# EasyEDA Pro project Chassis.epro

# Schematic Schematic1
Create Date: 2024-09-16; Page Name: P1; Project Name: 底盘控制模块916; Schematic Name: Schematic1; Update Date: 2024-09-16; Company: 嘉立创EDA; Page Size: A4; Version: V1.0
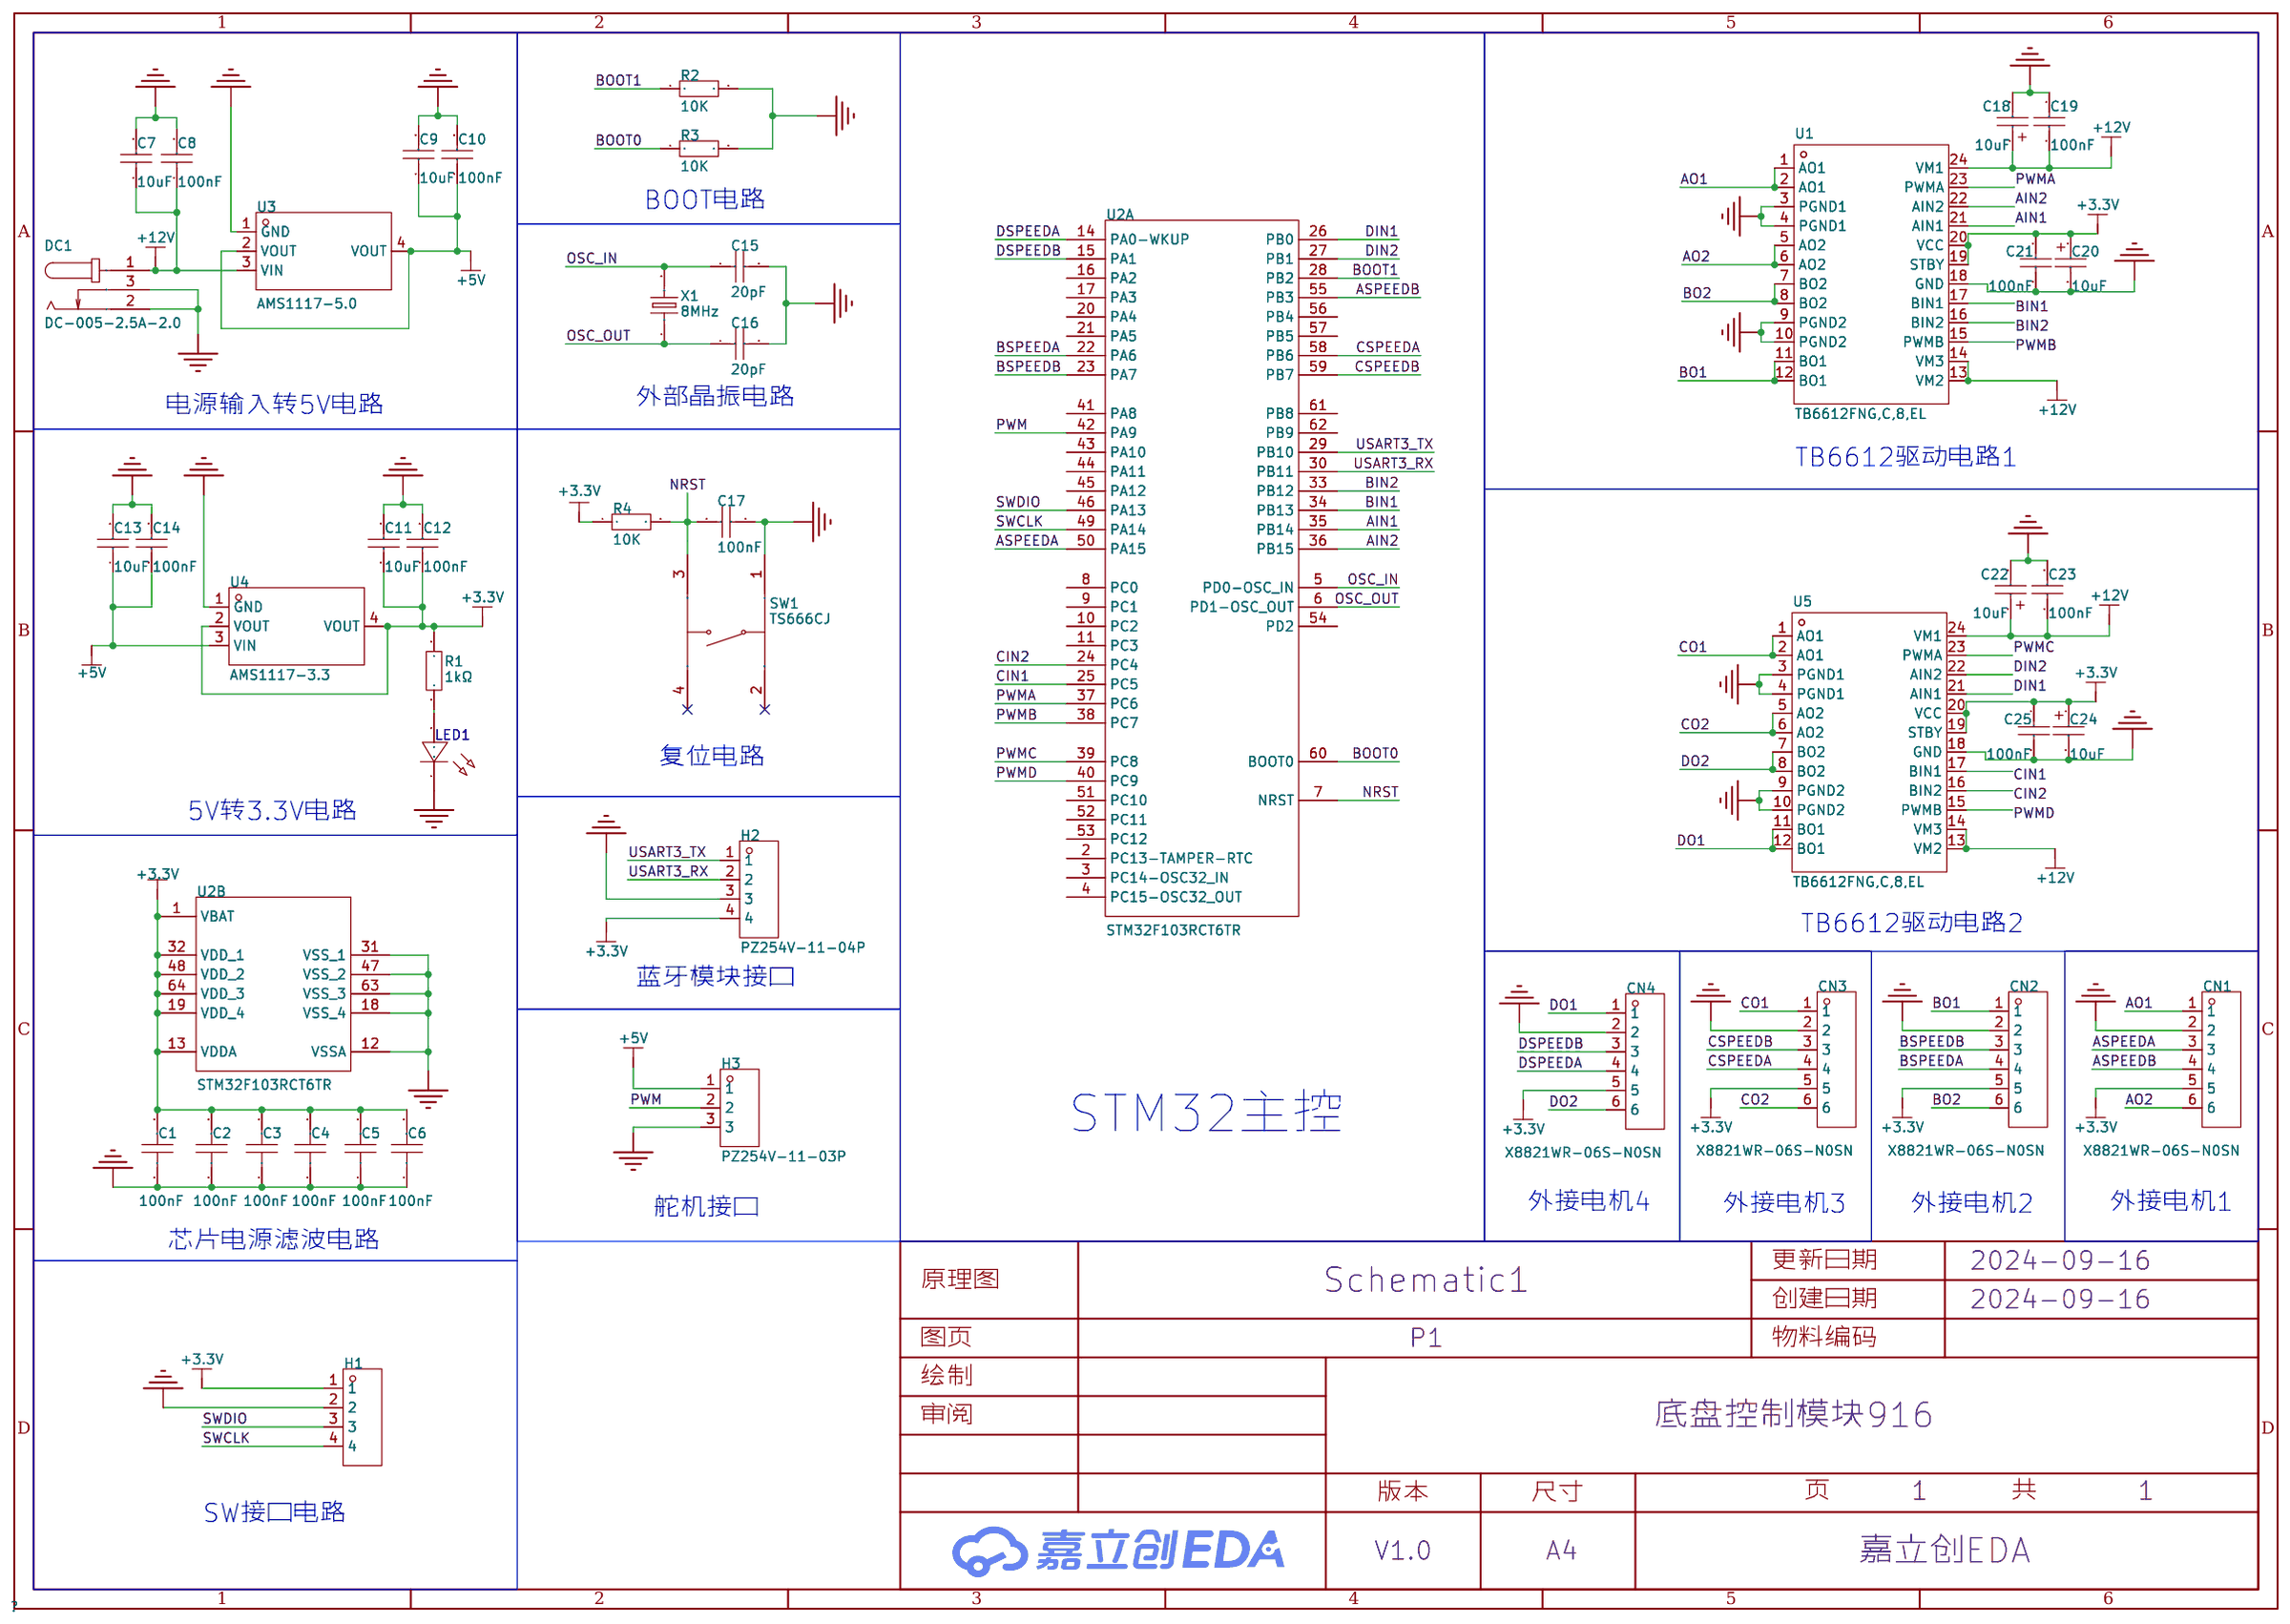
[diagram p0: schematic sheet]

## Parts
C1  100nF  [C0603]
C2  100nF  [C0603]
C3  100nF  [C0603]
C4  100nF  [C0603]
C5  100nF  [C0603]
C6  100nF  [C0603]
C7  10uF  [C0402]
C8  100nF  [C0402]
C9  10uF  [C0402]
C10  100nF  [C0402]
C11  10uF  [C0402]
C12  100nF  [C0402]
C13  10uF  [C0402]
C14  100nF  [C0402]
C15  20pF  [C0402]
C16  20pF  [C0402]
C17  100nF  [C0402]
C18  10uF  [CAP-SMD_L3.2-W1.6-RD-C7171]
C19  100nF  [C0402]
C20  10uF  [CAP-SMD_L3.2-W1.6-RD-C7171]
C21  100nF  [C0402]
C22  10uF  [CAP-SMD_L3.2-W1.6-RD-C7171]
C23  100nF  [C0402]
C24  10uF  [CAP-SMD_L3.2-W1.6-RD-C7171]
C25  100nF  [C0402]
CN1  X8821WR-06S-N0SN  [CONN-TH_6P-P2.50_X8821WR-06S-N2SN]
CN2  X8821WR-06S-N0SN  [CONN-TH_6P-P2.50_X8821WR-06S-N2SN]
CN3  X8821WR-06S-N0SN  [CONN-TH_6P-P2.50_X8821WR-06S-N2SN]
CN4  X8821WR-06S-N0SN  [CONN-TH_6P-P2.50_X8821WR-06S-N2SN]
DC1  DC-005-2.5A-2.0  [CONN-TH_DC-005-2.5A-2.0]
H1  -  [HDR-TH_4P-P2.54-V-M]
H2  PZ254V-11-04P  [HDR-TH_4P-P2.54-V-M]
H3  PZ254V-11-03P  [HDR-TH_3P-P2.54-V-M]
LED1  -  [LED_0805]
R1  1kΩ  [R0603]
R2  10K  [R0603]
R3  10K  [R0603]
R4  10K  [R0603]
SW1  TS666CJ  [SW-TH_4P-L6.0-W6.0-P4.50-LS6.5]
U1  TB6612FNG,C,8,EL  [SSOP-24_L8.3-W5.6-P0.65-LS7.6-BL]
U2  STM32F103RCT6TR  [LQFP-64_L10.0-W10.0-P0.50-LS12.0-BL]  (sections 1,2)
U3  AMS1117-5.0  [SOT-223_L6.5-W3.5-P2.30-LS7.0-BR]
U4  AMS1117-3.3  [SOT-223-3_L6.5-W3.4-P2.30-LS7.0-BR]
U5  TB6612FNG,C,8,EL  [SSOP-24_L8.3-W5.6-P0.65-LS7.6-BL]
X1  8MHz  [HC-49US_L11.5-W4.5-P4.88]

## Library data of the parts
C1-C6 = CAP_0603: Supplier Footprint: 0603
C7 C9 C11 C13 = CL05A106MQ5NUNC: 容值:10uF;精度:±20%;额定电压:6.3V;材质(温度系数):X5R;; LCSC Part Name: 10uF ±20% 6.3V; Supplier Part: C15525; Manufacturer: SAMSUNG(三星); Supplier Footprint: 0402; JLCPCB Part Class: 基础库; Datasheet: https://atta.szlcsc.com/upload/public/pdf/source/20220823/2B02EE04F8F211D38A52DCB16EB6BEBA.pdf; Supplier: LCSC; Tolerance: ±20%; Voltage Rated: 6.3V; Temperature Coefficient: X5R
C8 C10 C12 C14 C17 C19 C21 C23 C25 = CL05B104KO5NNNC: 容值:100nF;精度:±10%;额定电压:16V;材质(温度系数):X7R;; LCSC Part Name: 100nF ±10% 16V; Supplier Part: C1525; Manufacturer: SAMSUNG(三星); Supplier Footprint: 0402; JLCPCB Part Class: 基础库; Datasheet: https://atta.szlcsc.com/upload/public/pdf/source/20160218/1457707763339.pdf; Supplier: LCSC; Tolerance: ±10%; Voltage Rated: 16V; Temperature Coefficient: X7R
C15 C16 = 0402CG200J500NT: 容值:20pF;精度:±5%;额定电压:50V;材质(温度系数):C0G;; LCSC Part Name: 20pF ±5% 50V; Supplier Part: C1554; Manufacturer: FH(风华); Supplier Footprint: 0402; JLCPCB Part Class: 基础库; Datasheet: https://atta.szlcsc.com/upload/public/pdf/source/20200305/C486355_26A10D38EF8C2A5C37091D0039909270.pdf; Supplier: LCSC; Tolerance: ±5%; Voltage Rated: 50V; Temperature Coefficient: C0G
C18 C20 C22 C24 = TAJA106K016RNJ: 容值:10uF;精度:±10%;额定电压:16V;等效串联电阻:3Ω@100kHz;; LCSC Part Name: 10uF ±10% 16V; Supplier Part: C7171; Manufacturer: Kyocera AVX; Supplier Footprint: CASE-A-3216; JLCPCB Part Class: 基础库; Datasheet: https://atta.szlcsc.com/upload/public/pdf/source/20160107/1457707750344.pdf; Supplier: LCSC; Tolerance: ±10%; Rated Voltage: 16V; Equivalent Series Resistance(ESR): 3Ω@100kHz; Operating Temperature: -55℃~+125℃
CN1-CN4 = X8821WR-06S-N0SN: 插针结构:1x6P;间距:2.5mm;安装方式:弯插;参考系列:XH;总PIN数:6P;排数:1;每排PIN数:6;行距:-;额定电流:3A;触头材质:黄铜;触头镀层:锡;工作温度范围:-;; LCSC Part Name: 1x6P 间距:2.5mm 弯插 系列:XH; Supplier Part: C388743; Manufacturer: XKB Connection(中国星坤); Supplier Footprint: 弯插,P=2.54mm; JLCPCB Part Class: 扩展库; Datasheet: https://atta.szlcsc.com/upload/public/pdf/source/20211009/984C14C41D2B1156BCF8EEF5D296E395.pdf; Supplier: LCSC; Pins Structure: 1x6P; Pitch: 2.5mm; Mounting Style: 弯插; Reference Series: XH; Number of Pins: 6P; Number of Rows: 1; Number of PINs Per Row: 6; Current Rating (Max): 3A; Contact Material: 黄铜; Contact Plating: 锡
DC1 = DC-005-2.5A-2.0: 连接器类型:DC电源插座;安装方式:面板安装;触点内径:2mm;触点外径:6.2mm;额定电流:-;额定电压:-;触头材质:黄铜;触头镀层:-;工作温度范围:-20℃~+70℃;焊接温度(最大值):260℃;; LCSC Part Name: DC电源插座 内径:2mm 外径:6.2mm; Supplier Part: C319099; Manufacturer: XKB Connection(中国星坤); Supplier Footprint: 插件; JLCPCB Part Class: 扩展库; Datasheet: https://atta.szlcsc.com/upload/public/pdf/source/20230410/3C172F25A51FCA230ABE6D36425CBB3B.pdf; Supplier: LCSC; Connector Type: DC电源插座; Mounting Style: 面板安装; Inside Contact Diameter: 2mm; Outside Contact Diameter: 6.2mm; Contact Material: 黄铜; Operating Temperature Range: -20℃~+70℃; Soldering Temperature(Max): 260℃
H1 = HDR-M_2.54_1x4P: Supplier Part: C492403; Supplier Footprint: 插件
H2 = PZ254V-11-04P: 插针结构:1x4P;间距:2.54mm;行距:-;圆针/方针:方针;安装类型:直插;排数:单排;总PIN位数:4P;额定电流:3A;额定电压:250V;配合针长度:6mm;塑高:2.5mm;端接针长度:3mm;触头材质:-;工作温度范围:-40℃~+105℃;颜色:黑色;; LCSC Part Name: 间距:2.54mm 1x4P 直插 方针; Supplier Part: C2691448; Manufacturer: XFCN(兴飞); Supplier Footprint: 插件,P=2.54mm; JLCPCB Part Class: 扩展库; Datasheet: https://atta.szlcsc.com/upload/public/pdf/source/20200309/C492403_F9F19131791D08044AD4F84F8E751A34.pdf; Supplier: LCSC; Pin Structure: 1x4P; Pitch: 2.54mm; Circluar Pins/Square Pins: 方针; Mounting Type: 直插; Number of Rows: 单排; Number of Pins: 4P; Current Rating (Max): 3A; Voltage Rating (Max): 250V; Length of Mating Pin: 6mm; Insulation Height: 2.5mm; Length of End Connection Pin: 3mm; Operating Temperature Range: -40℃~+105℃; Color: 黑色
H3 = PZ254V-11-03P: 插针结构:1x3P;间距:2.54mm;行距:-;圆针/方针:方针;安装类型:直插;排数:单排;总PIN位数:3P;额定电流:3A;额定电压:250V;配合针长度:6mm;塑高:2.5mm;端接针长度:3mm;工作温度范围:-40℃~+105℃;颜色:黑色;; LCSC Part Name: 间距:2.54mm 1x3P 直插 方针; Supplier Part: C2937625; Manufacturer: XFCN(兴飞); Supplier Footprint: 插件,P=2.54mm; JLCPCB Part Class: 扩展库; Datasheet: https://atta.szlcsc.com/upload/public/pdf/source/20200309/C492402_8335C3D49C4E4C618838D59BB1D024C1.pdf; Supplier: LCSC; Pin Structure: 1x3P; Pitch: 2.54mm; Circluar Pins/Square Pins: 方针; Mounting Type: 直插; Number of Rows: 单排; Number of Pins: 3P; Current Rating (Max): 3A; Voltage Rating (Max): 250V; Length of Mating Pin: 6mm; Insulation Height: 2.5mm; Length of End Connection Pin: 3mm; Operating Temperature Range: -40℃~+105℃; Color: 黑色
LED1 = LED_0805-B: Supplier Footprint: 0805
R1 = 0603WAF1001T5E: 电阻类型:厚膜电阻;阻值:1kΩ;精度:±1%;功率:100mW;最大工作电压:75V;温度系数:±100ppm/℃;; LCSC Part Name: 1kΩ ±1% 100mW 厚膜电阻; Supplier Part: C21190; Manufacturer: UNI-ROYAL(厚声); Supplier Footprint: 0603; JLCPCB Part Class: 基础库; Datasheet: https://atta.szlcsc.com/upload/public/pdf/source/20200306/C422600_1E6D84923E4A46A82E41ADD87F860B5C.pdf; Supplier: LCSC; Type: 厚膜电阻; Tolerance: ±1%; Power(Watts): 100mW; Overload Voltage (Max): 75V; Temperature Coefficient: ±100ppm/℃; Operating Temperature Range: -55℃~+155℃
R2-R4 = Res_0603: Supplier Footprint: 0603
SW1 = TS666CJ: 电路结构:单刀单掷;按钮形状:圆形按钮;作用力:250gf;安装方式:直插;开关长度:6mm;开关宽度:6mm;开关高度:6mm;带支架:不带;触点电流:50mA;额定电压(DC):12V;绝缘电阻:100MΩ;机械寿命:5万次;; LCSC Part Name: 6*6*6mm 直插 轻触开关; Supplier Part: C557621; Manufacturer: SHOU HAN(首韩); Supplier Footprint: 插件; JLCPCB Part Class: 扩展库; Datasheet: https://atta.szlcsc.com/upload/public/pdf/source/20200519/C557621_524FC94A9E7193E97F84899CC7F1F8B2.pdf; Supplier: LCSC; Circuit: 单刀单掷; Actuator Style: 圆形按钮; Operating Force: 250gf; Mounting Style: 直插; Switch Length: 6mm; Switch Width: 6mm; Switch Height: 6mm; Strike Gundam: 不带; Contact Current: 50mA; Voltage Rating (DC): 12V; Insulation Resistance: 100MΩ; Actuator/Cap Color: 黑色; Pin Style: PC引脚; Mechanical Life: 5万次; Operating Temperature: -20℃~+85℃
U1 U5 = TB6612FNG,C,8,EL: LCSC Part Name: 1A 有刷直流电机驱动芯片 5.5V; Supplier Part: C141517; Manufacturer: TOSHIBA(东芝); Supplier Footprint: SSOP-24; JLCPCB Part Class: 扩展库; Datasheet: https://atta.szlcsc.com/upload/public/pdf/source/20171128/C141517_15118625624231147036.pdf; Supplier: LCSC
U2 = STM32F103RCT6TR: CPU内核:ARM-M3;程序存储容量:256KB;RAM总容量:48KB;GPIO端口数量:51;工作电压范围:2V~3.6V;CPU最大主频:72MHz;程序存储器类型:FLASH;; LCSC Part Name: 主流增强型ARM Cortex-M3 MCU，具有256 KB Flash、72 MHz CPU、电机控制、USB和CAN; Supplier Part: C39704; Manufacturer: ST(意法半导体); Supplier Footprint: LQFP-64(10x10); JLCPCB Part Class: 扩展库; Datasheet: https://atta.szlcsc.com/upload/public/pdf/source/20151012/1457707442737.pdf; Supplier: LCSC; CPU Core: ARM-M3; Program Storage Size: 256KB; RAM Size: 48KB; GPIO Ports Number: 51; Operating Voltage Range: 2V~3.6V; CPU Maximum Speed: 72MHz; Program Memory Type: FLASH; Operating Temperature Range: -40℃~+85℃; ADC (Bit): 12bit; DAC (Bit): 12bit; Universal Serial Bus: 有; Peripheral/Function: 看门狗；DMA；看门狗；温度传感器; Watchdog: 有; Infrared Data Association: 有; Low-Voltage Detect: 有; Direct Memory Access: 有; Internal Oscillator: 有
U3 = AMS1117-5.0_C6187: 输出类型:固定;最大输入电压:12V;输出电压:5V;最大输出电流:1A;电源纹波抑制比(PSRR):68dB@(120Hz);输出极性:正极;; LCSC Part Name: 输入12V 输出5V 1A; Supplier Part: C6187; Manufacturer: AMS; Supplier Footprint: SOT-223; JLCPCB Part Class: 基础库; Datasheet: https://atta.szlcsc.com/upload/public/pdf/source/20230918/E4B716057EE82179D88E8A0894830D59.pdf; Supplier: LCSC; Output Type: 固定; Maximum Input Voltage: 12V; Output Voltage: 5V; MAX Output Current: 1A; Power Supply Rejection Ratio (PSRR): 68dB@(120Hz); Dropout Voltage: 1.3V@(1A); Output Polarity: 正极; Number of Outputs: 1
U4 = AMS1117-3.3_C6186: 输出类型:固定;最大输入电压:-;输出电压:3.3V;最大输出电流:1A;电源纹波抑制比(PSRR):72dB@(120Hz);输出极性:正极;; LCSC Part Name: 输出3.3V 1A; Supplier Part: C6186; Manufacturer: AMS; Supplier Footprint: SOT-223; JLCPCB Part Class: 基础库; Datasheet: https://atta.szlcsc.com/upload/public/pdf/source/20180727/C6186_7A095716F0823C02F1997A905E26C086.pdf; Supplier: LCSC; Output Type: 固定; Output Voltage: 3.3V; MAX Output Current: 1A; Power Supply Rejection Ratio (PSRR): 72dB@(120Hz); Dropout Voltage: 1.3V@(800mA); Output Polarity: 正极; Number of Outputs: 1
X1 = 49S-8.000-20-20-20/A: 晶振类型:直插晶振;频率:8MHz;常温频差:±20ppm;外接负载电容:20pF;频率稳定度(全温):±20ppm;; LCSC Part Name: 8MHz ±20ppm 20pF; Supplier Part: C240916; Manufacturer: LIMING(利明); Supplier Footprint: HC-49S; JLCPCB Part Class: 扩展库; Datasheet: https://atta.szlcsc.com/upload/public/pdf/source/20180930/C240954_D21D826943E58A9880472B1227802F84.pdf; Supplier: LCSC; Crystal Type: 直插晶振; Normal temperature Frequency Tolerance: ±20ppm; External load capacitor: 20pF; Frequency Stability(Full temperature range): ±20ppm; Operating Temperature: -20℃~+70℃

## Nets
+3.3V: C1.2 C2.2 C3.2 C4.2 C5.2 C6.2 C11.1 C12.1 C20.1 C21.1 C24.1 C25.1 CN1.5 CN2.5 CN3.5 CN4.5 H1.1 H2.4 R1.1 R4.1 U1.19(STBY) U1.20(VCC) U2.1(VBAT) U2.13(VDDA) U2.19(VDD_4) U2.32(VDD_1) U2.48(VDD_2) U2.64(VDD_3) U4.2(VOUT) U4.4(VOUT) U5.19(STBY) U5.20(VCC)
+5V: C9.1 C10.1 C13.1 C14.1 H3.1 U3.2(VOUT) U3.4(VOUT) U4.3(VIN)
+12V: C7.1 C8.1 C18.1 C19.1 C22.1 C23.1 DC1.1 U1.13(VM2) U1.14(VM3) U1.24(VM1) U3.3(VIN) U5.13(VM2) U5.14(VM3) U5.24(VM1)
GND: C1.1 C2.1 C3.1 C4.1 C5.1 C6.1 C7.2 C8.2 C9.2 C10.2 C11.2 C12.2 C13.2 C14.2 C15.2 C16.2 C17.1 C18.2 C19.2 C20.2 C21.2 C22.2 C23.2 C24.2 C25.2 CN1.2 CN2.2 CN3.2 CN4.2 DC1.2 DC1.3 H1.2 H2.3 H3.3 LED1.1(C) R2.2 R3.2 SW1.1(A) U1.3(PGND1) U1.4(PGND1) U1.9(PGND2) U1.10(PGND2) U1.18(GND) U2.12(VSSA) U2.18(VSS_4) U2.31(VSS_1) U2.47(VSS_2) U2.63(VSS_3) U3.1(GND) U4.1(GND) U5.3(PGND1) U5.4(PGND1) U5.9(PGND2) U5.10(PGND2) U5.18(GND)
AIN1: U1.21(AIN1) U2.35(PB14)
AIN2: U1.22(AIN2) U2.36(PB15)
AO1: CN1.1 U1.1(AO1) U1.2(AO1)
AO2: CN1.6 U1.5(AO2) U1.6(AO2)
ASPEEDA: CN1.3 U2.50(PA15)
ASPEEDB: CN1.4 U2.55(PB3)
BIN1: U1.17(BIN1) U2.34(PB13)
BIN2: U1.16(BIN2) U2.33(PB12)
BO1: CN2.1 U1.11(BO1) U1.12(BO1)
BO2: CN2.6 U1.7(BO2) U1.8(BO2)
BOOT0: R3.1 U2.60(BOOT0)
BOOT1: R2.1 U2.28(PB2)
BSPEEDA: CN2.4 U2.22(PA6)
BSPEEDB: CN2.3 U2.23(PA7)
CIN1: U2.25(PC5) U5.17(BIN1)
CIN2: U2.24(PC4) U5.16(BIN2)
CO1: CN3.1 U5.1(AO1) U5.2(AO1)
CO2: CN3.6 U5.5(AO2) U5.6(AO2)
CSPEEDA: CN3.4 U2.58(PB6)
CSPEEDB: CN3.3 U2.59(PB7)
DIN1: U2.26(PB0) U5.21(AIN1)
DIN2: U2.27(PB1) U5.22(AIN2)
DO1: CN4.1 U5.11(BO1) U5.12(BO1)
DO2: CN4.6 U5.7(BO2) U5.8(BO2)
DSPEEDA: CN4.4 U2.14(PA0-WKUP)
DSPEEDB: CN4.3 U2.15(PA1)
NRST: C17.2 R4.2 SW1.3(C) U2.7(NRST)
OSC_IN: C15.1 U2.5(PD0-OSC_IN) X1.2
OSC_OUT: C16.1 U2.6(PD1-OSC_OUT) X1.1
PWM: H3.2 U2.42(PA9)
PWMA: U1.23(PWMA) U2.37(PC6)
PWMB: U1.15(PWMB) U2.38(PC7)
PWMC: U2.39(PC8) U5.23(PWMA)
PWMD: U2.40(PC9) U5.15(PWMB)
SWCLK: H1.4 U2.49(PA14)
SWDIO: H1.3 U2.46(PA13)
USART3_RX: H2.2 U2.30(PB11)
USART3_TX: H2.1 U2.29(PB10)
$1N661: LED1.2(A) R1.2

Not connected (* = marked no-connect by the designer): SW1 2(B)* 4(D)*; U2 2(PC13-TAMPER-RTC) 3(PC14-OSC32_IN) 4(PC15-OSC32_OUT) 8(PC0) 9(PC1) 10(PC2) 11(PC3) 16(PA2) 17(PA3) 20(PA4) 21(PA5) 41(PA8) 43(PA10) 44(PA11) 45(PA12) 51(PC10) 52(PC11) 53(PC12) 54(PD2) 56(PB4) 57(PB5) 61(PB8) 62(PB9)

## Notes on the sheet
- BOOT电路
- 外部晶振电路
- 电源输入转5V电路
- TB6612驱动电路1
- 复位电路
- 5V转3.3V电路
- TB6612驱动电路2
- 蓝牙模块接口
- STM32主控
- 舵机接口
- 外接电机4
- 外接电机3
- 外接电机2
- 外接电机1
- 芯片电源滤波电路
- SW接口电路

# Board PCB1
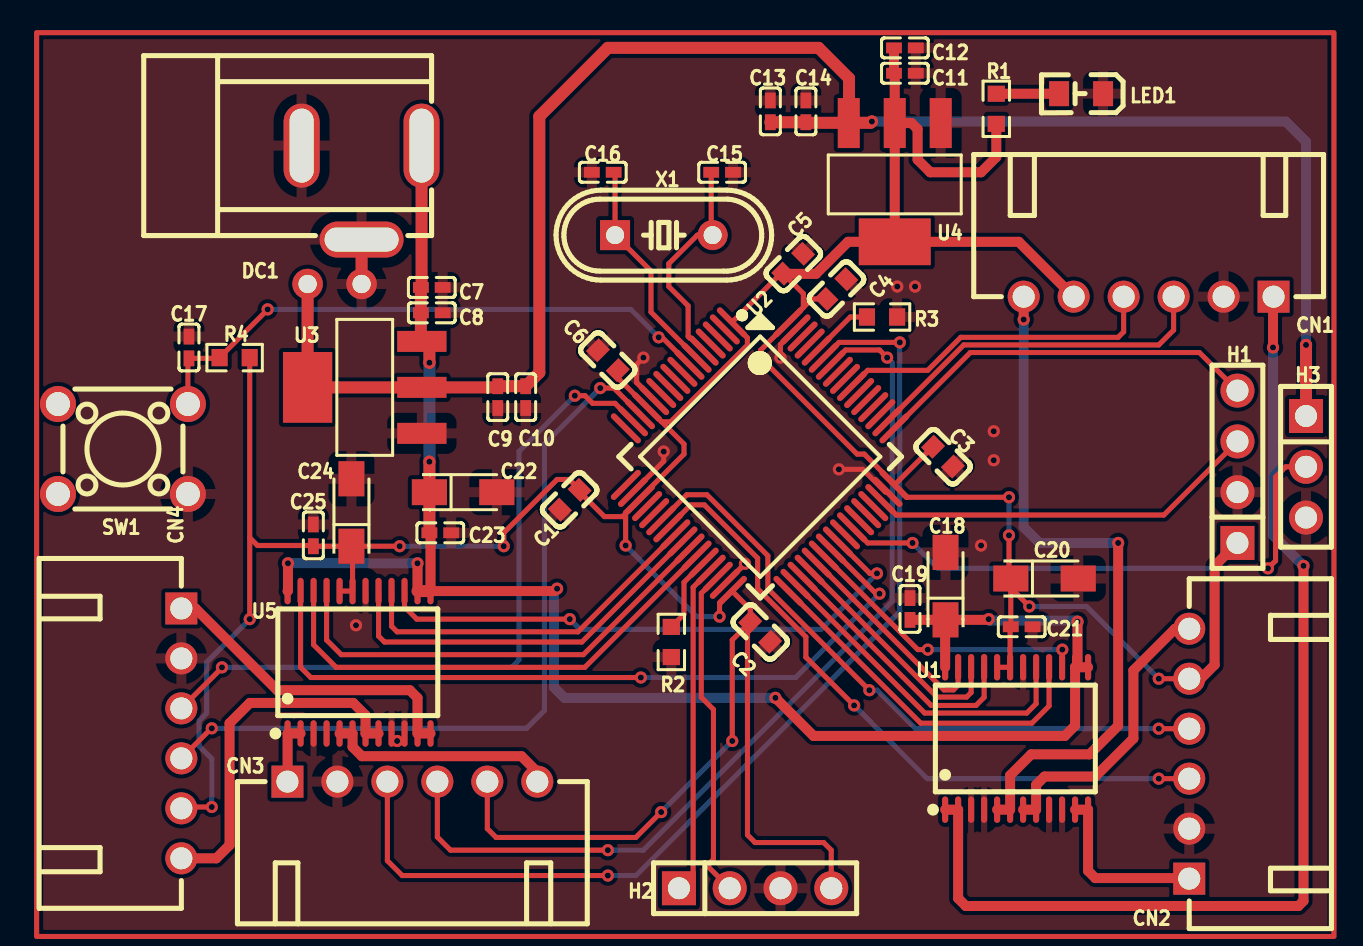
[diagram p1: board, top side]
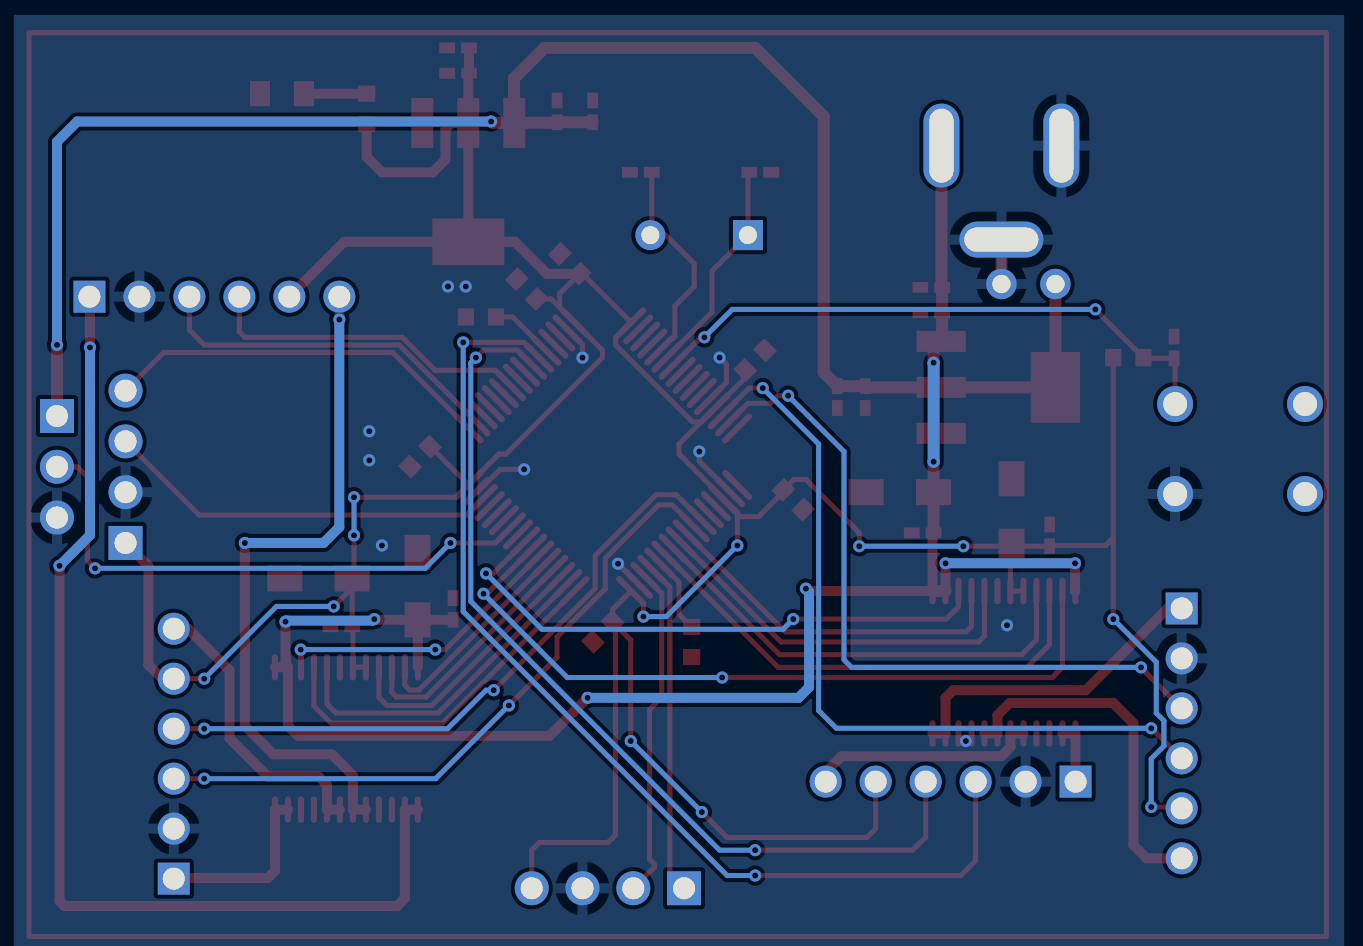
[diagram p2: board, bottom side, seen from below]

No outline. copper layers: Top Layer, Bottom Layer. Coordinates in mm from the lowest, leftmost part position.
Stack: Top Layer 0.035mm / Dielectric1 1.51mm FR4 er 4.5 / Bottom Layer 0.035mm

## Design rules (mm)
net SWDIO: DP2
net SWCLK: DP2
net OSC_IN: DP1
net OSC_OUT: DP1
net USART3_RX: DP3
net USART3_TX: DP3
template: JLCPCB Capability(Two Layers Board)
spacing copperThickness1oz (default): track to track 0.102, other pairs 0.152 to 0.3
spacing copperThickness2oz: track to track 0.203, other pairs 0.152 to 0.3
track width copperThickness1oz (default): min 0.127, default 0.254, max 2.54
track width copperThickness2oz: min 0.203, default 0.254, max 2.54
differential pair differentialPair (default): width min 0.127, default 0.254, max 2.54; gap min 0.152, default 0.152
via viaSize (default): diameter min 0.5, default 0.61, max 10; hole min 0.3, default 0.305, max 6.3

## Placement (name value [footprint] x y rotation side)
C1  100nF  [C0603]  22.35 19.43 45 top
C2  100nF  [C0603]  31.88 12.83 135 top
C3  100nF  [C0603]  41.02 21.59 135 top
C4  100nF  [C0603]  35.69 29.97 225 top
C5  100nF  [C0603]  33.53 31.24 225 top
C6  100nF  [C0603]  24.26 26.42 315 top
C7  10uF  [C0402]  15.45 30.05 0 top
C8  100nF  [C0402]  15.45 28.78 0 top
C9  10uF  [C0402]  18.75 24.57 270 top
C10  100nF  [C0402]  20.15 24.57 270 top
C11  10uF  [C0402]  39.12 40.77 0 top
C12  100nF  [C0402]  39.12 42.04 0 top
C13  10uF  [C0402]  32.39 38.86 90 top
C14  100nF  [C0402]  34.16 38.86 90 top
C15  20pF  [C0402]  29.97 35.81 0 top
C16  20pF  [C0402]  24 35.81 180 top
C17  100nF  [C0402]  3.3 27.05 270 top
C18  10uF  [CAP-SMD_L3.2-W1.6-RD-C7171]  41.15 15.11 90 top
C19  100nF  [C0402]  39.37 13.97 90 top
C20  10uF  [CAP-SMD_L3.2-W1.6-RD-C7171]  46.1 15.49 0 top
C21  100nF  [C0402]  44.96 13.08 0 top
C22  10uF  [CAP-SMD_L3.2-W1.6-RD-C7171]  17.02 19.81 0 top
C23  100nF  [C0402]  15.88 17.78 0 top
C24  10uF  [CAP-SMD_L3.2-W1.6-RD-C7171]  11.43 18.8 90 top
C25  100nF  [C0402]  9.53 17.65 90 top
CN1  X8821WR-06S-N0SN  [CONN-TH_6P-P2.50_X8821WR-06S-N2SN]  51.31 29.59 180 top
CN2  X8821WR-06S-N0SN  [CONN-TH_6P-P2.50_X8821WR-06S-N2SN]  53.34 6.73 90 top
CN3  X8821WR-06S-N0SN  [CONN-TH_6P-P2.50_X8821WR-06S-N2SN]  14.48 5.33 0 top
CN4  X8821WR-06S-N0SN  [CONN-TH_6P-P2.50_X8821WR-06S-N2SN]  2.92 7.75 270 top
DC1  DC-005-2.5A-2.0  [CONN-TH_DC-005-2.5A-2.0]  11.94 34.8 0 top
H1  -  [HDR-TH_4P-P2.54-V-M]  55.75 21.08 90 top
H2  PZ254V-11-04P  [HDR-TH_4P-P2.54-V-M]  31.62 0 0 top
H3  PZ254V-11-03P  [HDR-TH_3P-P2.54-V-M]  59.18 21.08 270 top
LED1  -  [LED_0805]  47.88 39.75 180 top
NOREF  -  [Pad_e1956]  11.94 30.23 0 top
NOREF#2  -  [Pad_e1948]  9.24 30.23 0 top
R1  1kΩ  [R0603]  43.69 38.99 90 top
R2  10K  [R0603]  27.43 12.32 270 top
R3  10K  [R0603]  37.97 28.57 0 top
R4  10K  [R0603]  5.59 26.54 180 top
SW1  TS666CJ  [SW-TH_4P-L6.0-W6.0-P4.50-LS6.5]  0 21.97 180 top
U1  TB6612FNG,C,8,EL  [SSOP-24_L8.3-W5.6-P0.65-LS7.6-BL]  44.7 7.49 0 top
U2  STM32F103RCT6TR  [LQFP-64_L10.0-W10.0-P0.50-LS12.0-BL]  31.88 21.59 225 top
U3  AMS1117-5.0  [SOT-223_L6.5-W3.5-P2.30-LS7.0-BR]  12.09 25.05 0 top
U4  AMS1117-3.3  [SOT-223-3_L6.5-W3.4-P2.30-LS7.0-BR]  38.61 35.31 90 top
U5  TB6612FNG,C,8,EL  [SSOP-24_L8.3-W5.6-P0.65-LS7.6-BL]  11.81 11.3 0 top
X1  8MHz  [HC-49US_L11.5-W4.5-P4.88]  27.06 32.67 0 top

## Footprints (pads in the part's own frame, mm; a bottom-side part is the same pattern mirrored in y, then rotated)
C0402
  rect 0.79x0.54 smd: 1(-0.545,0) 2(0.545,0)
C0603
  rect 0.8x0.9 smd: 1(-0.7,0) 2(0.7,0)
CAP-SMD_L3.2-W1.6-RD-C7171
  rect 1.758x1.296 smd: 1(-1.687,0) 2(1.687,0)
CONN-TH_6P-P2.50_X8821WR-06S-N2SN
  rect 1.6x1.6 hole 1.1: 1(-6.25,0)
  round 1.6 hole 1.1: 2(-3.75,0) 3(-1.25,0) 4(1.25,0) 5(3.75,0) 6(6.25,0)
CONN-TH_DC-005-2.5A-2.0
  oval 1.8x4.2 hole 1.2x3.7: 1(2.999,2.35) 2(-2.999,2.35)
  oval 4.2x1.8 hole 3.7x1.2: 3(0,-2.35)
HC-49US_L11.5-W4.5-P4.88
  rect 1.5x1.5 hole 0.9: 1(-2.44,0)
  round 1.5 hole 0.9: 2(2.44,0)
HDR-TH_3P-P2.54-V-M
  rect 1.7x1.7 hole 1.1: 1(-2.54,0)
  round 1.7 hole 1.1: 2(0,0) 3(2.54,0)
HDR-TH_4P-P2.54-V-M
  rect 1.7x1.7 hole 1.1: 1(-3.81,0)
  round 1.7 hole 1.1: 2(-1.27,0) 3(1.27,0) 4(3.81,0)
LED_0805
  rect 1x1.25 smd: 1(-1.15,0.005) 2(1.05,0.005)
LQFP-64_L10.0-W10.0-P0.50-LS12.0-BL
  oval 0.3x2 smd: 1(-3.75,-5.75) 2(-3.25,-5.75) 3(-2.75,-5.75) 4(-2.25,-5.75) 5(-1.75,-5.75) 6(-1.25,-5.75) 7(-0.75,-5.75) 8(-0.25,-5.75) 9(0.25,-5.75) 10(0.75,-5.75) 11(1.25,-5.75) 12(1.75,-5.75) 13(2.25,-5.75) 14(2.75,-5.75) 15(3.25,-5.75) 16(3.75,-5.75) 33(3.75,5.75) 34(3.25,5.75) 35(2.75,5.75) 36(2.25,5.75) 37(1.75,5.75) 38(1.25,5.75) 39(0.75,5.75) 40(0.25,5.75) 41(-0.25,5.75) 42(-0.75,5.75) 43(-1.25,5.75) 44(-1.75,5.75) 45(-2.25,5.75) 46(-2.75,5.75) 47(-3.25,5.75) 48(-3.75,5.75)
  oval 2x0.3 smd: 17(5.75,-3.75) 18(5.75,-3.25) 19(5.75,-2.75) 20(5.75,-2.25) 21(5.75,-1.75) 22(5.75,-1.25) 23(5.75,-0.75) 24(5.75,-0.25) 25(5.75,0.25) 26(5.75,0.75) 27(5.75,1.25) 28(5.75,1.75) 29(5.75,2.25) 30(5.75,2.75) 31(5.75,3.25) 32(5.75,3.75) 49(-5.75,3.75) 50(-5.75,3.25) 51(-5.75,2.75) 52(-5.75,2.25) 53(-5.75,1.75) 54(-5.75,1.25) 55(-5.75,0.75) 56(-5.75,0.25) 57(-5.75,-0.25) 58(-5.75,-0.75) 59(-5.75,-1.25) 60(-5.75,-1.75) 61(-5.75,-2.25) 62(-5.75,-2.75) 63(-5.75,-3.25) 64(-5.75,-3.75)
Pad_e1948
  round 1.524 hole 0.914: 5(0,0)
Pad_e1956
  round 1.524 hole 0.914: 6(0,0)
R0603
  rect 0.806x0.864 smd: 1(-0.753,0) 2(0.753,0)
SOT-223-3_L6.5-W3.4-P2.30-LS7.0-BR
  rect 2.5x1.1 smd: 1(2.97,-2.3) 2(2.97,0) 3(2.97,2.3)
  rect 2.34x3.6 smd: 4(-2.97,0)
SOT-223_L6.5-W3.5-P2.30-LS7.0-BR
  rect 2.465x1.05 smd: 1(2.857,-2.3) 2(2.857,0) 3(2.857,2.3)
  rect 2.465x3.54 smd: 4(-2.857,0)
SSOP-24_L8.3-W5.6-P0.65-LS7.6-BL
  oval 0.308x1.324 smd: 1(-3.575,-3.562) 2(-2.925,-3.562) 3(-2.275,-3.562) 4(-1.625,-3.562) 5(-0.975,-3.562) 6(-0.325,-3.562) 7(0.325,-3.562) 8(0.975,-3.562) 9(1.625,-3.562) 10(2.275,-3.562) 11(2.925,-3.562) 12(3.575,-3.562) 13(3.575,3.562) 14(2.925,3.562) 15(2.275,3.562) 16(1.625,3.562) 17(0.975,3.562) 18(0.325,3.562) 19(-0.325,3.562) 20(-0.975,3.562) 21(-1.625,3.562) 22(-2.275,3.562) 23(-2.925,3.562) 24(-3.575,3.562)
SW-TH_4P-L6.0-W6.0-P4.50-LS6.5
  round 1.8 hole 1.2: 1(-3.25,2.25) 2(3.25,2.25) 3(-3.25,-2.25) 4(3.25,-2.25)

## Nets
As in the schematic, except:
+5V: C9.1 C10.1 C13.1 C14.1 H3.1 NOREF#2.5 U3.2 U3.4 U4.3
GND: C1.1 C2.1 C3.1 C4.1 C5.1 C6.1 C7.2 C8.2 C9.2 C10.2 C11.2 C12.2 C13.2 C14.2 C15.2 C16.2 C17.1 C18.2 C19.2 C20.2 C21.2 C22.2 C23.2 C24.2 C25.2 CN1.2 CN2.2 CN3.2 CN4.2 DC1.2 DC1.3 H1.2 H2.3 H3.3 LED1.1 NOREF.6 R2.2 R3.2 SW1.1 U1.3 U1.4 U1.9 U1.10 U1.18 U2.12 U2.18 U2.31 U2.47 U2.63 U3.1 U4.1 U5.3 U5.4 U5.9 U5.10 U5.18

Pads without a net: SW1 2 4; U2 2 3 4 8 9 10 11 16 17 20 21 41 43 44 45 51 52 53 54 56 57 61 62

## Via types
v1: diameter 0.61, hole 0.305, Top Layer to Bottom Layer, 60 vias

## Routing (per net, layer and track width the routed paths; a pad name or vN(x,y) marks a point on that pad's centre or on a via; arc(x,y) is an arc through that point)
+3.3V: length 211
  Top Layer w0.254: v1(13.84,17.11) C24.1 11.49,17.05 U5.19 U5.20 ; 26.95,23.33 U2.13 24.75,25.53 24.75,25.92 ; 26.95,23.33 27.4,23.33 31.24,27.17 31.24,27.53 U2.1 32.9,30.75 C5.2 ; 26.95,23.33 28.07,22.22 28.07,21.72 25.87,19.52 ; 25.87,19.52 U2.19 25.15,18.75 ; 25.87,19.52 25.15,18.8 25.15,18.75 ; 44.41,15.02 44.41,13.08 ; 44.41,15.02 v1(45.34,14.1) ; 44.41,15.02 C20.1 44.32,15.59 v1(44.32,17.65) ; 6.34,17.53 6.73,17.14 9.49,17.14 C25.1 11.43,17.11 ; 6.34,17.53 v1(6.34,13.46) ; 6.34,17.53 R4.1 ; 34.04,29.05 34.46,29.48 C4.2 ; 34.04,29.05 U2.64 31.89,26.91 31.89,26.55 36.73,21.72 37.08,21.72 38.59,20.21 U2.48 ; 34.04,29.05 34.04,29.74 33.05,30.73 ; CN3.5 18.23,2.98 18.67,2.54 25.65,2.54 v1(26.92,3.81) ; 25.15,18.75 24.99,18.59 24.08,18.59 22.85,19.82 22.85,19.93 22.33,20.45 21.72,20.45 19.05,17.78 v1(19.05,17.11) ; 25.15,18.75 v1(25.15,17.14) ; v1(29.84,13.59) 29.84,14.25 U2.32 31.38,13.95 31.38,13.32 31.24,13.18 ; U1.20 U1.19 44.38,13.05 C21.1 ; CN2.5 v1(51.82,10.48) ; U2.48 39.21,19.56 v1(44.32,19.56) ; U2.48 40.5,22.08 40.53,22.08 ; H2.4 35.43,1.91 35.05,2.29 31.62,2.29 31.24,2.67 31.24,13.18 ; CN4.5 2.99,4.06 v1(4.45,4.06) ; 31.24,13.18 30.48,12.42 v1(30.48,7.37)
  Top Layer w0.5: CN2.5 53.92,10.48 54.61,11.18 54.61,16.13 H1.1 ; U4.2 38.61,40.73 C11.1 C12.1 ; U4.2 U4.4 ; U4.2 39.45,38.28 39.75,37.97 39.75,36.45 40.39,35.81 42.93,35.81 43.69,36.58 R1.1 ; U4.4 44.81,32.34 CN1.5 ; U4.4 36.27,32.34 34.67,30.73 33.05,30.73 C5.2
  Bottom Layer w0.254: v1(25.15,17.14) 28.7,13.59 v1(29.84,13.59) ; v1(51.82,10.48) 48.2,14.1 v1(45.34,14.1) ; v1(13.84,17.11) v1(19.05,17.11) ; v1(4.45,4.06) 4.45,6.48 3.81,7.11 3.81,8.38 4.19,8.76 4.19,11.31 v1(6.34,13.46) ; v1(26.92,3.81) v1(30.48,7.37) ; v1(44.32,19.56) v1(44.32,17.65)
+5V: length 90.6
  Top Layer w0.6: C13.1 C14.1 34.19,38.29 36.32,38.29 ; 36.32,38.29 36.31,38.28 ; 36.32,38.29 37.4,38.29 v1(37.47,38.35) ; 36.32,38.29 36.32,40.51 34.8,42.04 24.26,42.04 20.83,38.61 20.83,25.79 C10.1 C9.1 18.69,25.05 U3.2 U3.4 NOREF#2.5 ; v1(59.18,27.18) H3.1
  Bottom Layer w0.5: v1(37.47,38.35) 58.17,38.35 59.18,37.34 v1(59.18,27.18)
+12V: length 87.8
  Top Layer w0.5: v1(8.26,16.26) 8.26,14.88 U5.24 ; C23.1 15.39,17.72 U5.13 21.6,14.86 v1(21.72,14.99) ; U1.14 47.75,11.18 v1(47.75,13.33) ; U1.14 U1.13 ; U1.14 47.63,8.13 47.12,7.62 34.54,7.62 v1(32.64,9.53) ; U1.24 41.13,13.41 C18.1 ; C18.1 39.37,13.43 ; C18.1 43.27,13.43 v1(43.31,13.46) ; v1(14.73,16.26) 14.74,16.25 U5.14
  Top Layer w0.6: DC1.1 14.94,30.09 C7.1 C8.1 14.9,27.4 U3.3 15.33,26.98 v1(15.33,26.29) ; U5.13 U5.14 ; v1(15.33,21.34) C23.1
  Bottom Layer w0.5: v1(14.73,16.26) v1(8.26,16.26) ; v1(32.64,9.53) 22.09,9.53 21.56,10.06 21.56,14.83 v1(21.72,14.99) ; v1(47.75,13.33) 47.7,13.39 43.38,13.39 v1(43.31,13.46)
  Bottom Layer w0.6: v1(15.33,21.34) v1(15.33,26.29)
GND: length 13.6
  Top Layer w0.254: v1(26.04,26.54) 25.7,26.2 25.7,25.3 U2.12 ; U2.31 v1(31.12,16.23) 31.12,16.26 ; 33.64,27.95 32.89,27.2 v1(32.89,26.54) ; U2.47 38.14,19.82 37.01,20.95 v1(35.81,20.95) ; v1(27.05,21.84) 27.05,21.36 U2.18
  Top Layer w0.6: DC1.3 NOREF.6
  vias: v1(11.66,13.15) v1(13.72,7.37) v1(38.74,30.1) v1(39.62,30.1) v1(42.93,17.14) v1(43.56,22.86) v1(43.56,21.41)
AIN1: length 13.4
  Top Layer w0.254: U1.21 43.08,9.55 42.67,9.14 40.43,9.14 34,15.58
AIN2: length 12.1
  Top Layer w0.254: 34.35,15.93 40.72,9.56 42.2,9.56 42.43,9.79 U1.22
AO1: length 53.5
  Top Layer w0.5: CN1.1 57.53,29.56 v1(57.53,27.05) ; v1(59.06,16.13) 59.06,-0.64 58.8,-0.89 42.16,-0.89 41.78,-0.5 U1.2 U1.1
  Bottom Layer w0.5: v1(57.53,27.05) 57.53,17.65 v1(59.06,16.13)
AO2: length 34.5
  Top Layer w0.5: v1(49.78,17.27) 49.78,8.13 48.35,6.7 45.43,6.7 44.38,5.64 U1.6 U1.5 ; CN1.6 v1(45.06,28.45)
  Bottom Layer w0.5: v1(45.06,28.45) 45.06,18.06 45.85,17.27 v1(49.78,17.27)
ASPEEDA: length 17.9
  Top Layer w0.254: CN1.3 52.56,27.92 51.82,27.18 42.06,27.18 U2.50
ASPEEDB: length 16.5
  Top Layer w0.254: CN1.4 50.06,27.83 49.78,27.56 41.91,27.56 40.26,25.91 37.26,25.91 U2.55
BIN1: length 16.7
  Top Layer w0.254: U1.17 45.68,9.23 45.21,8.76 40.11,8.76 U2.34
BIN2: length 18.1
  Top Layer w0.254: U1.16 46.33,9.12 45.47,8.25 39.91,8.25 U2.33
BO1: length 8.9
  Top Layer w0.5: CN2.1 53.31,0.51 48.64,0.51 48.28,0.87 U1.12 U1.11
BO2: length 14.8
  Top Layer w0.5: CN2.6 52.63,12.98 50.55,10.89 50.55,7.49 48.64,5.59 46.1,5.59 45.68,5.17 U1.8 U1.7
BOOT0: length 3.2
  Top Layer w0.254: R3.1 36.39,28.57 U2.60
BOOT1: length 3.9
  Top Layer w0.254: R2.1 28.07,13.71 28.07,15.3 U2.28
BSPEEDA: length 32.8
  Top Layer w0.254: 26.93,18.41 28.2,19.69 29.21,19.69 32.26,16.63 32.26,14.98 v1(37.34,9.91) ; CN2.4 v1(51.82,7.98)
  Bottom Layer w0.254: v1(37.34,9.91) 37.72,9.91 39.64,7.98 v1(51.82,7.98)
BSPEEDB: length 33.7
  Top Layer w0.254: U2.23 28.4,19.18 29.08,19.18 31.75,16.51 31.75,14.99 34.16,12.57 34.16,11.56 v1(36.58,9.14) ; CN2.3 v1(51.82,5.48)
  Bottom Layer w0.254: v1(36.58,9.14) 40.24,5.48 v1(51.82,5.48)
CIN1: length 19.7
  Top Layer w0.254: U5.17 12.79,12.61 13.08,12.32 22.96,12.32 27.99,17.35
CIN2: length 18.1
  Top Layer w0.254: U2.24 22.76,12.83 13.72,12.83 13.44,13.11 U5.16
CO1: length 3.1
  Top Layer w0.5: CN3.1 8.24,5.34 U5.1 U5.2
CO2: length 11.6
  Top Layer w0.5: CN3.6 20.73,5.81 19.94,6.6 11.95,6.6 11.49,7.07 U5.6 U5.5
CSPEEDA: length 46.5
  Top Layer w0.254: v1(38.23,26.54) 37.85,26.92 36.15,26.92 U2.58 ; v1(24.26,1.91) 16.38,1.91 15.73,2.56 CN3.4
  Bottom Layer w0.254: v1(24.26,1.91) 26.04,1.91 38.48,14.35 38.48,26.29 v1(38.23,26.54)
CSPEEDB: length 53
  Top Layer w0.254: U2.59 35.82,27.3 v1(38.86,27.3) ; v1(24.26,0.63) 13.97,0.63 13.23,1.38 CN3.3
  Bottom Layer w0.254: v1(24.26,0.63) 25.65,0.63 38.86,13.84 v1(38.86,27.3)
DIN1: length 23.1
  Top Layer w0.254: 28.34,16.99 23.03,11.68 10.92,11.68 10.19,12.42 U5.21
DIN2: length 24.6
  Top Layer w0.254: U5.22 9.54,12.18 10.67,11.05 23.1,11.05 U2.27
DO1: length 16.1
  Top Layer w0.5: CN4.1 3.63,14 7.72,9.91 14.35,9.91 14.74,9.52 U5.11 U5.12
DO2: length 17.8
  Top Layer w0.5: U5.8 12.14,7.74 12.14,8.65 11.52,9.27 6.35,9.27 5.33,8.25 5.33,2.16 4.67,1.5 CN4.6
DSPEEDA: length 39
  Top Layer w0.254: v1(4.45,8) 4.43,8 CN4.4 ; U2.14 24.56,25.02 v1(23.88,25.02)
  Bottom Layer w0.254: v1(23.88,25.02) 21.08,22.22 21.08,8.89 20.19,8 v1(4.45,8)
DSPEEDB: length 35.7
  Top Layer w0.254: v1(22.61,24.64) 23.11,24.64 23.5,24.26 24.61,24.26 U2.15 ; v1(4.95,11.05) 4.95,11.03 CN4.3
  Bottom Layer w0.254: v1(4.95,11.05) 19.43,11.05 19.81,11.43 19.81,21.84 v1(22.61,24.64)
NRST: length 29.5
  Top Layer w0.254: SW1.3 3.25,26.45 C17.2 4.8,26.51 R4.2 7.24,28.95 v1(7.24,28.96) ; v1(26.8,27.56) 26.97,27.56 U2.7
  Bottom Layer w0.254: v1(7.24,28.96) 25.4,28.96 v1(26.8,27.56)
OSC_IN: length 11.1
  Top Layer w0.254: C15.1 29.43,32.74 X1.2 28.73,32.67 27.31,31.24 27.31,30.1 28.27,29.13 28.27,27.6 28.36,27.51 28.43,27.51 U2.5
OSC_OUT: length 11
  Top Layer w0.254: C16.1 24.62,35.74 X1.1 26.42,30.87 26.42,28.82 U2.6
PWM: length 28.1
  Top Layer w0.254: v1(57.28,16) 57.66,16.38 57.66,20.57 58.17,21.08 H3.2 ; U2.42 37.26,17.27 v1(39.5,17.27)
  Bottom Layer w0.254: v1(57.28,16) 40.77,16 v1(39.5,17.27)
PWMA: length 10.7
  Top Layer w0.254: U1.23 41.78,10.16 41.54,9.92 41.07,9.92 U2.37
PWMB: length 14.8
  Top Layer w0.254: U1.15 46.99,11.07 v1(46.99,11.94) ; v1(40.26,11.94) 39.76,11.94 U2.38
  Bottom Layer w0.254: v1(40.26,11.94) v1(46.99,11.94)
PWMC: length 38.1
  Top Layer w0.254: U5.23 8.89,11.05 9.4,10.54 v1(25.91,10.54) ; 35.41,16.99 37.67,14.73 v1(37.85,14.73)
  Bottom Layer w0.254: v1(37.85,14.73) 33.66,10.54 v1(25.91,10.54)
PWMD: length 28.7
  Top Layer w0.254: v1(22.35,13.46) 14.7,13.46 14.09,14.08 U5.15 ; 35.77,17.35 37.37,15.75 v1(37.72,15.75)
  Bottom Layer w0.254: v1(37.72,15.75) 34.93,12.95 22.86,12.95 v1(22.35,13.46)
SWCLK: length 19.5
  Top Layer w0.254: 38.59,23 42.39,26.8 53.85,26.8 H1.4
SWDIO: length 19.7
  Top Layer w0.254: H1.3 52.07,18.67 38.69,18.67 U2.46
USART3_RX: length 16.7
  Top Layer w0.254: H2.2 29.29,1.07 29.29,1.19 29.54,1.45 29.54,8.94 28.93,9.55 28.93,14.75 29.76,15.58
USART3_TX: length 16.6
  Top Layer w0.254: H2.1 28.52,0.71 28.52,15.06 29.4,15.93
$1N661: length 3.1
  Top Layer w0.5: R1.2 46.83,39.74 LED1.2

## Copper pours and planes (outline as drawn; the poured copper is in the pictures)
GND on Top Layer: -4.95,43.31 61.34,43.31 61.34,-2.79 -4.95,-2.79
GND on Bottom Layer: -5.21,43.69 61.34,43.69 61.34,-3.18 -5.21,-3.18
